# Altium schematic sheet CW340_HyperDebug.SchDoc: <Enter Sheet Title>
size Letter; Organization: NewAE Technology Inc.; Address1: 1083 Queen St., Suite 196; Address2: Halifax; Address3: NS; Address4: Canada B3H 0B2; SheetApproved: NO
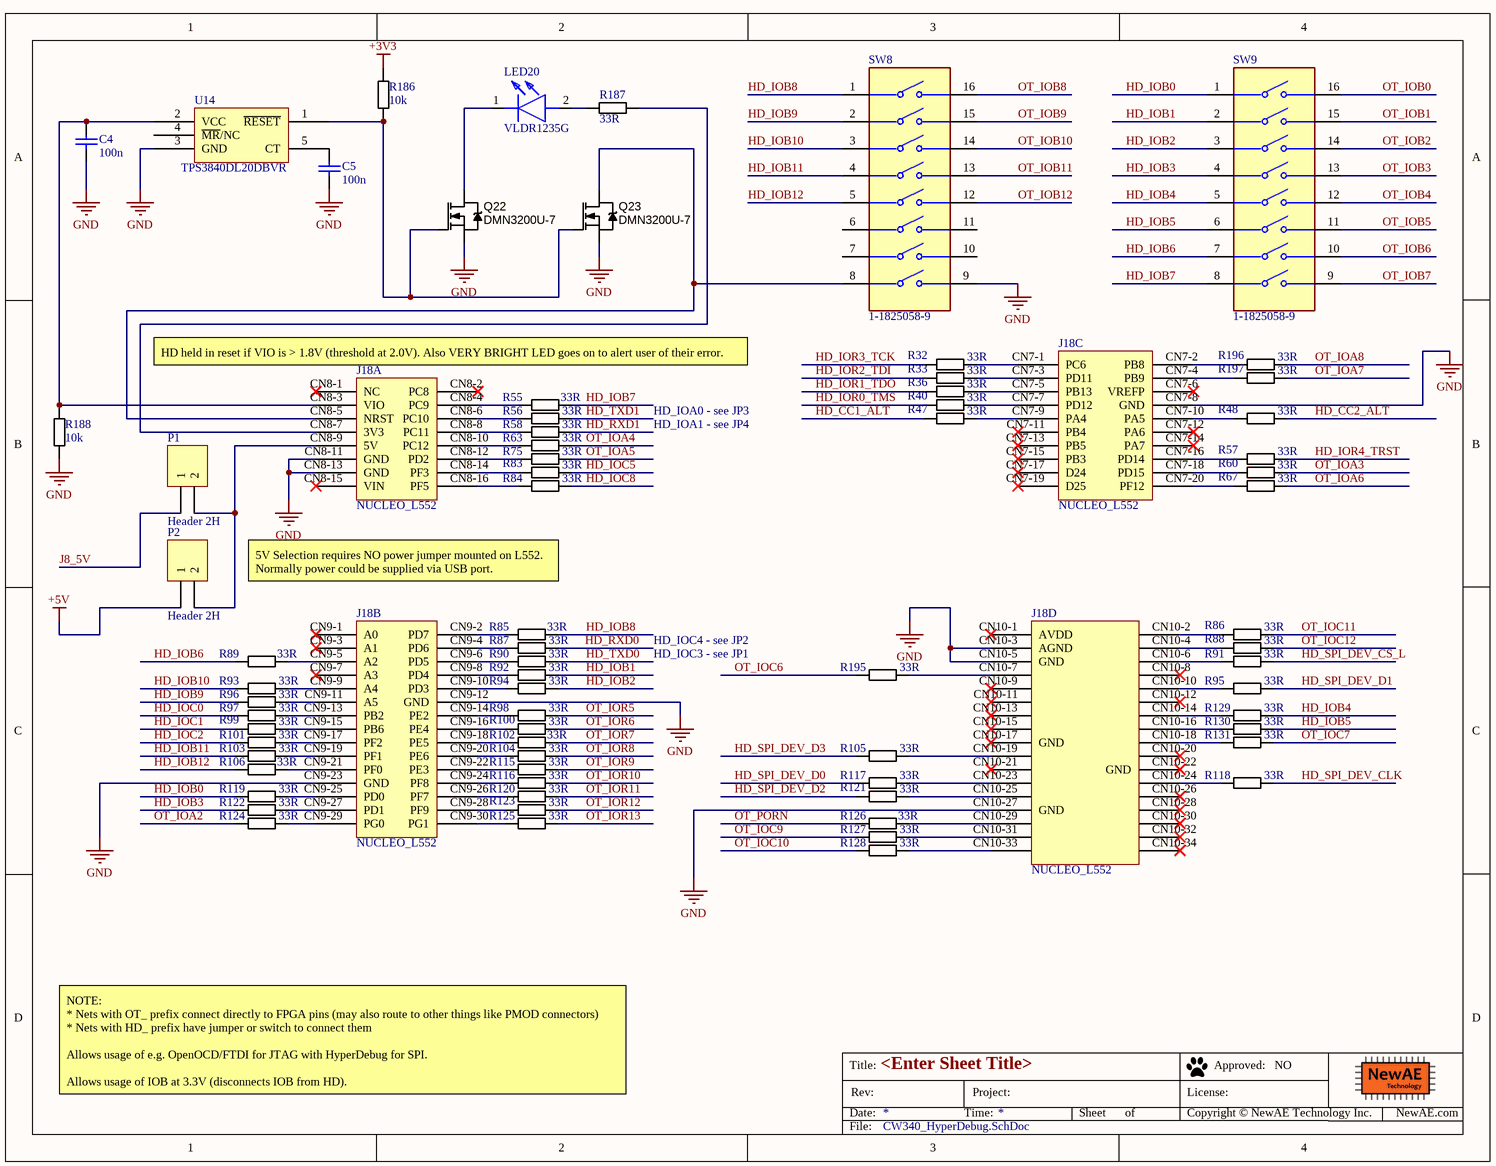
[diagram p0: CW340_HyperDebug.SchDoc]

## Parts
C4  100n  [CAPC0402_M]
C5  100n  [CAPC0402_M]
J18  NUCLEO_L552  [NUCLEO-L552ZE]  (parts A,B,C,D of 4)
LED20  VLDR1235G  [VLDR1235G]
P1  Header 2H  [HDR1X2H]
P2  Header 2H  [HDR1X2H]
Q22  DMN3200U-7  [SOT95P245X110-3M]
Q23  DMN3200U-7  [SOT95P245X110-3M]
R32  33R  [RESC1608X55N]
R33  33R  [RESC1608X55N]
R36  33R  [RESC1608X55N]
R40  33R  [RESC1608X55N]
R47  33R  [RESC1608X55N]
R48  33R  [RESC1608X55N]
R55  33R  [RESC1608X55N]
R56  33R  [RESC1608X55N]
R57  33R  [RESC1608X55N]
R58  33R  [RESC1608X55N]
R60  33R  [RESC1608X55N]
R63  33R  [RESC1608X55N]
R67  33R  [RESC1608X55N]
R75  33R  [RESC1608X55N]
R83  33R  [RESC1608X55N]
R84  33R  [RESC1608X55N]
R85  33R  [RESC1608X55N]
R86  33R  [RESC1608X55N]
R87  33R  [RESC1608X55N]
R88  33R  [RESC1608X55N]
R89  33R  [RESC1608X55N]
R90  33R  [RESC1608X55N]
R91  33R  [RESC1608X55N]
R92  33R  [RESC1608X55N]
R93  33R  [RESC1608X55N]
R94  33R  [RESC1608X55N]
R95  33R  [RESC1608X55N]
R96  33R  [RESC1608X55N]
R97  33R  [RESC1608X55N]
R98  33R  [RESC1608X55N]
R99  33R  [RESC1608X55N]
R100  33R  [RESC1608X55N]
R101  33R  [RESC1608X55N]
R102  33R  [RESC1608X55N]
R103  33R  [RESC1608X55N]
R104  33R  [RESC1608X55N]
R105  33R  [RESC1608X55N]
R106  33R  [RESC1608X55N]
R115  33R  [RESC1608X55N]
R116  33R  [RESC1608X55N]
R117  33R  [RESC1608X55N]
R118  33R  [RESC1608X55N]
R119  33R  [RESC1608X55N]
R120  33R  [RESC1608X55N]
R121  33R  [RESC1608X55N]
R122  33R  [RESC1608X55N]
R123  33R  [RESC1608X55N]
R124  33R  [RESC1608X55N]
R125  33R  [RESC1608X55N]
R126  33R  [RESC1608X55N]
R127  33R  [RESC1608X55N]
R128  33R  [RESC1608X55N]
R129  33R  [RESC1608X55N]
R130  33R  [RESC1608X55N]
R131  33R  [RESC1608X55N]
R186  10k  [RESC1005X40N]
R187  33R  [RESC1608X55N]
R188  10k  [RESC1005X40N]
R195  33R  [RESC1608X55N]
R196  33R  [RESC1608X55N]
R197  33R  [RESC1608X55N]
SW8  1-1825058-9  [FP-1-1825058-9-MFG]
SW9  1-1825058-9  [FP-1-1825058-9-MFG]
U14  TPS3840DL20DBVR  [SOT23-5P95_285X145L45X40]

## Nets
+3V3: R186.1
+5V: P2.1
GND: C4.2 C5.2 J18.CN7-8(GND) J18.CN8-11(GND) J18.CN8-13(GND) J18.CN9-12(GND) J18.CN9-23(GND) J18.CN10-3(AGND) J18.CN10-5(GND) J18.CN10-27(GND) Q22.2(S) Q23.2(S) R188.2 SW8.9 U14.3(GND)
HD_CC1_ALT: R47.1
HD_CC2_ALT: R48.2
HD_IOB0: R119.1 SW9.1
HD_IOB1: R92.2 SW9.2
HD_IOB2: R94.2 SW9.3
HD_IOB3: R122.1 SW9.4
HD_IOB4: R129.2 SW9.5
HD_IOB5: R130.2 SW9.6
HD_IOB6: R89.1 SW9.7
HD_IOB7: R55.2 SW9.8
HD_IOB8: R85.2 SW8.1
HD_IOB9: R96.1 SW8.2
HD_IOB10: R93.1 SW8.3
HD_IOB11: R103.1 SW8.4
HD_IOB12: R106.1 SW8.5
HD_IOC0: R97.1
HD_IOC1: R99.1
HD_IOC2: R101.1
HD_IOC5: R83.2
HD_IOC8: R84.2
HD_IOR0_TMS: R40.1
HD_IOR1_TDO: R36.1
HD_IOR2_TDI: R33.1
HD_IOR3_TCK: R32.1
HD_IOR4_TRST: R57.2
HD_RXD0: R87.2
HD_RXD1: R58.2
HD_SPI_DEV_CLK: R118.2
HD_SPI_DEV_CS_L: R91.2
HD_SPI_DEV_D0: R117.1
HD_SPI_DEV_D1: R95.2
HD_SPI_DEV_D2: R121.1
HD_SPI_DEV_D3: R105.1
HD_TXD0: R90.2
HD_TXD1: R56.2
J8_5V: P1.1
OT_IOA2: R124.1
OT_IOA3: R60.2
OT_IOA4: R63.2
OT_IOA5: R75.2
OT_IOA6: R67.2
OT_IOA7: R197.2
OT_IOA8: R196.2
OT_IOB0: SW9.16
OT_IOB1: SW9.15
OT_IOB2: SW9.14
OT_IOB3: SW9.13
OT_IOB4: SW9.12
OT_IOB5: SW9.11
OT_IOB6: SW9.10
OT_IOB7: SW9.9
OT_IOB8: SW8.16
OT_IOB9: SW8.15
OT_IOB10: SW8.14
OT_IOB11: SW8.13
OT_IOB12: SW8.12
OT_IOC6: R195.1
OT_IOC7: R131.2
OT_IOC9: R127.1
OT_IOC10: R128.1
OT_IOC11: R86.2
OT_IOC12: R88.2
OT_IOR5: R98.2
OT_IOR6: R100.2
OT_IOR7: R102.2
OT_IOR8: R104.2
OT_IOR9: R115.2
OT_IOR10: R116.2
OT_IOR11: R120.2
OT_IOR12: R123.2
OT_IOR13: R125.2
OT_PORN: R126.1
NetC4_1: C4.1 J18.CN8-3(VIO) R188.1 U14.2(VCC)
NetC5_1: C5.1 U14.5(CT)
NetJ18_CN7-1: J18.CN7-1(PC6) R32.2
NetJ18_CN7-2: J18.CN7-2(PB8) R196.1
NetJ18_CN7-3: J18.CN7-3(PD11) R33.2
NetJ18_CN7-4: J18.CN7-4(PB9) R197.1
NetJ18_CN7-5: J18.CN7-5(PB13) R36.2
NetJ18_CN7-7: J18.CN7-7(PD12) R40.2
NetJ18_CN7-9: J18.CN7-9(PA4) R47.2
NetJ18_CN7-10: J18.CN7-10(PA5) R48.1
NetJ18_CN7-16: J18.CN7-16(PD14) R57.1
NetJ18_CN7-18: J18.CN7-18(PD15) R60.1
NetJ18_CN7-20: J18.CN7-20(PF12) R67.1
NetJ18_CN8-4: J18.CN8-4(PC9) R55.1
NetJ18_CN8-5: J18.CN8-5(NRST) Q23.3(D) SW8.8
NetJ18_CN8-6: J18.CN8-6(PC10) R56.1
NetJ18_CN8-7: J18.CN8-7(3V3) R187.2
NetJ18_CN8-8: J18.CN8-8(PC11) R58.1
NetJ18_CN8-9: J18.CN8-9(5V) P1.2 P2.2
NetJ18_CN8-10: J18.CN8-10(PC12) R63.1
NetJ18_CN8-12: J18.CN8-12(PD2) R75.1
NetJ18_CN8-14: J18.CN8-14(PF3) R83.1
NetJ18_CN8-16: J18.CN8-16(PF5) R84.1
NetJ18_CN9-2: J18.CN9-2(PD7) R85.1
NetJ18_CN9-4: J18.CN9-4(PD6) R87.1
NetJ18_CN9-5: J18.CN9-5(A2) R89.2
NetJ18_CN9-6: J18.CN9-6(PD5) R90.1
NetJ18_CN9-8: J18.CN9-8(PD4) R92.1
NetJ18_CN9-9: J18.CN9-9(A4) R93.2
NetJ18_CN9-10: J18.CN9-10(PD3) R94.1
NetJ18_CN9-11: J18.CN9-11(A5) R96.2
NetJ18_CN9-13: J18.CN9-13(PB2) R97.2
NetJ18_CN9-14: J18.CN9-14(PE2) R98.1
NetJ18_CN9-15: J18.CN9-15(PB6) R99.2
NetJ18_CN9-16: J18.CN9-16(PE4) R100.1
NetJ18_CN9-17: J18.CN9-17(PF2) R101.2
NetJ18_CN9-18: J18.CN9-18(PE5) R102.1
NetJ18_CN9-19: J18.CN9-19(PF1) R103.2
NetJ18_CN9-20: J18.CN9-20(PE6) R104.1
NetJ18_CN9-21: J18.CN9-21(PF0) R106.2
NetJ18_CN9-22: J18.CN9-22(PE3) R115.1
NetJ18_CN9-24: J18.CN9-24(PF8) R116.1
NetJ18_CN9-25: J18.CN9-25(PD0) R119.2
NetJ18_CN9-26: J18.CN9-26(PF7) R120.1
NetJ18_CN9-27: J18.CN9-27(PD1) R122.2
NetJ18_CN9-28: J18.CN9-28(PF9) R123.1
NetJ18_CN9-29: J18.CN9-29(PG0) R124.2
NetJ18_CN9-30: J18.CN9-30(PG1) R125.1
NetJ18_CN10-2: J18.CN10-2 R86.1
NetJ18_CN10-4: J18.CN10-4 R88.1
NetJ18_CN10-6: J18.CN10-6 R91.1
NetJ18_CN10-7: J18.CN10-7 R195.2
NetJ18_CN10-10: J18.CN10-10 R95.1
NetJ18_CN10-14: J18.CN10-14 R129.1
NetJ18_CN10-16: J18.CN10-16 R130.1
NetJ18_CN10-18: J18.CN10-18 R131.1
NetJ18_CN10-19: J18.CN10-19 R105.2
NetJ18_CN10-23: J18.CN10-23 R117.2
NetJ18_CN10-24: J18.CN10-24 R118.1
NetJ18_CN10-25: J18.CN10-25 R121.2
NetJ18_CN10-29: J18.CN10-29 R126.2
NetJ18_CN10-31: J18.CN10-31 R127.2
NetJ18_CN10-33: J18.CN10-33 R128.2
NetLED20_1: LED20.1(K) Q22.3(D)
NetLED20_2: LED20.2(A) R187.1
NetQ22_1: Q22.1(G) Q23.1(G) R186.2 U14.1(~{RESET})

Not connected (* = marked no-connect by the designer): J18 CN7-6(VREFP)* CN7-11(PB4)* CN7-12(PA6)* CN7-13(PB5)* CN7-14(PA7)* CN7-15(PB3)* CN7-17(D24)* CN7-19(D25)* CN8-1(NC)* CN8-2(PC8)* CN8-15(VIN)* CN9-1(A0)* CN9-3(A1)* CN9-7(A3)* CN10-1(AVDD)* CN10-8* CN10-9* CN10-11* CN10-12* CN10-13* CN10-15* CN10-17(GND)* CN10-20* CN10-21* CN10-22(GND)* CN10-26* CN10-28* CN10-30* CN10-32* CN10-34*; SW8 6 7 10 11; U14 4(~{MR}/NC)

## Notes on the sheet
- HD held in reset if VIO is > 1.8V (threshold at 2.0V). Also VERY BRIGHT LED goes on to alert user of their error.
- HD_IOA0 - see JP3
- HD_IOA1 - see JP4
- 5V Selection requires NO power jumper mounted on L552. Normally power could be supplied via USB port.
- HD_IOC4 - see JP2
- HD_IOC3 - see JP1
- NOTE:
  * Nets with OT_ prefix connect directly to FPGA pins (may also route to other things like PMOD connectors)
  * Nets with HD_ prefix have jumper or switch to connect them
  Allows usage of e.g. OpenOCD/FTDI for JTAG with HyperDebug for SPI.
  Allows usage of IOB at 3.3V (disconnects IOB from HD).
- Title:
- Date:
- Rev:
- Time:
- Project:
- Sheet
- of
- License:
- Copyright © NewAE Technology Inc.
- Approved:
- NewAE.com
- File:

## Library data of the parts
C4 C5 = CCHIP-100n-0402: 100n, 0402; Manufacture Part Number 1: CGA2B3X7R1V104K050BB; Component Group: Capacitor; Case-EIA: 0402; Part Number: CCHIP-100n-0402; Footprint: 0402; Pin Count: 2; Supplier 1: Digi-Key; Supplier Part Number 1: 445-6901-1-ND; Value: 100n; Mounting Technology: SMT; Component Kind: Standard; Component Type: Standard
J18 = NUCLEO_L552: PP Material Stack: 0; Part Number: NUCLEO_L552; Footprint: NUCLEO_L552; Component Kind: Standard; Component Type: Standard; PP Rotation: 0; PP Rotation1: 0
LED20 = VLDR1235G: LED; Manufacturer_Name: Vishay; Datasheet Link: https://componentsearchengine.com/Datasheets/2/VLDR1235G.pdf; Height: 3.02mm; Manufacturer_Part_Number: VLDR1235G; Mouser Part Number: 78-VLDR1235G; Mouser Price/Stock: https://www.mouser.co.uk/ProductDetail/Vishay-Semiconductors/VLDR1235G?qs=8%2FCviTG%2FVKTO7E0D0YN3Xw%3D%3D; Arrow Part Number: VLDR1235G; Arrow Price/Stock: https://www.arrow.com/en/products/vldr1235g/vishay?region=nac
P1 P2 = Header 2H: Header, 2-Pin, Right Angle; LatestRevisionDate: 17-Jul-2002; LatestRevisionNote: Re-released for DXP Platform.; Publisher: Altium Limited
Q22 Q23 = DMN3200U-7: MOSFET N-CH 30V 2.2A SOT23-3; Manufacture 1: Diodes Inc.; Rated Power: 3A; PP Material Stack: 0; Part Number: DMN3200U-7; Component Group: MOSFET; Footprint: SOT23; Manufacture Part Number 1: DMN3200U-7; Pin Count: 3; Supplier 1: Digi-Key; Supplier Part Number 1: DMN3200U-7DICT-ND; Rated Voltage: 30V; Mounting Technology: SMT; RoHS: Yes; Component Kind: Standard; Component Type: Standard; PP Rotation: 0
R32 R33 R36 R40 R47 R48 R55-R58 R60 R63 R67 R75 R83-R106 R115-R131 R187 R195-R197 = RCHIP-33R-0603: 33R res, 0603, 1%, 1/10W; Manufacture 1: Yageo; Manufacture Part Number 1: RC0603FR-0733RL; Component Group: Resistor; Case-EIA: 0603; Case-Metric: 1608; Rated Power: 0.1W; Rated Voltage: 75VDC; Part Number: RCHIP-33R-0603; Footprint: 0603; Pin Count: 2; Supplier 1: Digi-Key; Supplier Part Number 1: 311-33.0HRCT-ND; Value: 33R; Tolerance: 1%; Mounting Technology: SMT; Temperature Range: -55C to 155C; Component Kind: Standard; Component Type: Standard
R186 R188 = RCHIP-10K-0402: 10k res, 0402, 1%, 1/16W; Manufacture 1: Yageo; Manufacture Part Number 1: RC0402FR-0710KL; Component Group: Resistor; Case-EIA: 0402; Case-Metric: 1005; Rated Power: 0.063W; Rated Voltage: 75VDC; Part Number: RCHIP-10K-0402; Footprint: 0402; Pin Count: 2; Supplier 1: Digi-Key; Supplier Part Number 1: 311-10.0KLRCT-ND; Value: 10k; Tolerance: 1%; Mounting Technology: SMT; Temperature Range: -55C to 155C; Component Kind: Standard; Component Type: Standard
SW8 SW9 = CMP-03400-000015-1: SWITCH SLIDE DIP SPST 100MA 24V; Manufacturer: TE Connectivity; Current Rating: 1A; Electromechanical Life: 1000Cycles; Contact Resistance: 50mΩ; Number Of Circuits: 8; Device Class L1: Electromechanical; Manufacturer Part Number: 1-1825058-9; Height: 5.1mm; ComponentLink2Description: Datasheet; Temperature Range High: +85°C; Digikey Description: SWITCH SLIDE DIP SPST 100MA 24V; Voltage Rating Dc: 24V; Package: 0; Automotive: No; ComponentLink2URL: https://www.te.com/commerce/DocumentDelivery/DDEController?Action=showdoc&DocId=Customer+Drawing%7F1825058%7FS5%7Fpdf%7FEnglish%7FENG_CD_1825058_S5.pdf%7F1-1825058-9; Octopart: https://octopart.com/1-1825058-9-te+connectivity-46507285; Temperature Range Low: -30°C; Device Class L2: Switches; Contact Current Rating: 100mA; Mount: Surface Mount; Temperature: -30°C to +85°C; Category: Switch; Device Class L3: DIP Switches; Lead Free: Yes; Throw Configuration: SPST; RoHS: TRUE
U14 = TPS3840DL20DBVR: Reset Supervisor; Manufacture 1: Texas Instruments; Component Group: Analog IC; PP Material Stack: 0; Part Number: TPS3840DL20DBVR; Footprint: SOT25; Manufacture Part Number 1: TPS3840DL20DBVR; Pin Count: 5; Supplier 1: Digi-Key; Supplier Part Number 1: TPS3840DL20DBVRCT-ND; Mounting Technology: SMT; RoHS: Yes; Component Kind: Standard; Component Type: Standard; PP Rotation: 0